# Altium schematic sheet SH9 - RS-485.SchDoc: RS-485
size B; CheckedBy: Cindy Li; DrawnBy: Farris Matar; Engineer: Farris Matar; Organization: UW Robotics; Address1: 200 University Avenue; Address2: Waterloo; Address3: Ontario; Address4: Canada N2L 3G6; DocumentNumber: 9; Revision: 3; SheetNumber: 9; SheetTotal: 9
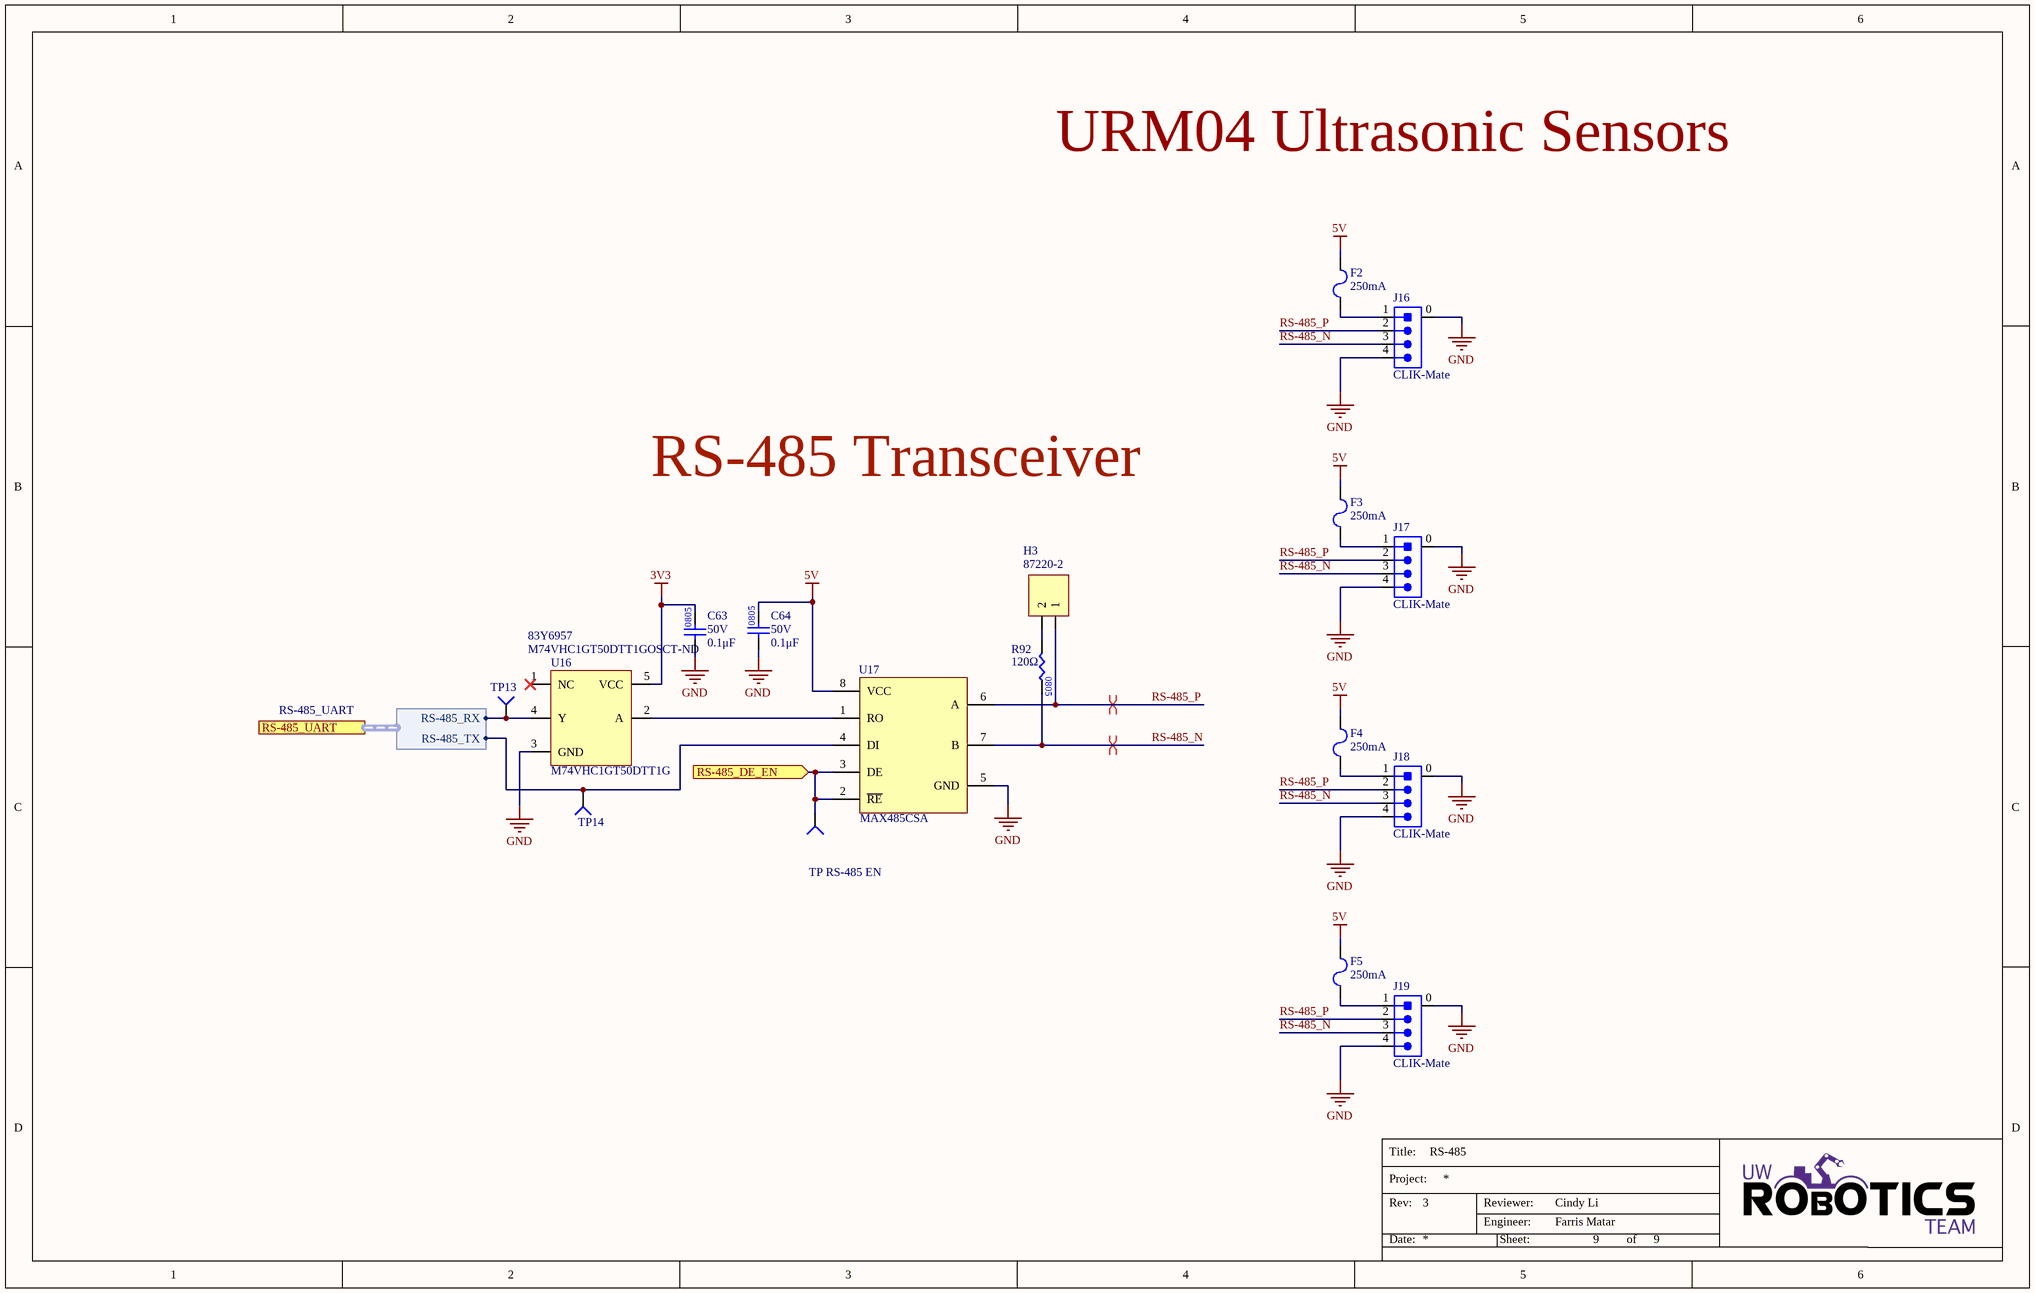
[diagram p0: SH9 - RS-485.SchDoc]

## Parts
C63  value 0.1μF  Voltage Rating: 50V  [CAP2012]  (hidden comment: CAP_0.1uF_50V_0805)
C64  value 0.1μF  Voltage Rating: 50V  [CAP2012]  (hidden comment: CAP_0.1uF_50V_0805)
F2  Current Rating: 250mA  [FUSE_1206]  (hidden comment: FUSE_250mA_1206)
F3  Current Rating: 250mA  [FUSE_1206]  (hidden comment: FUSE_250mA_1206)
F4  Current Rating: 250mA  [FUSE_1206]  (hidden comment: FUSE_250mA_1206)
F5  Current Rating: 250mA  [FUSE_1206]  (hidden comment: FUSE_250mA_1206)
H3  Manufacturer Part Number 1: 87220-2  [HDR1X2]  (hidden comment: JUMPER_2)
J16  Family: CLIK-Mate  [MOLEX-5025850470]  (hidden comment: CON_4M_SM_RA)
J17  Family: CLIK-Mate  [MOLEX-5025850470]  (hidden comment: CON_4M_SM_RA)
J18  Family: CLIK-Mate  [MOLEX-5025850470]  (hidden comment: CON_4M_SM_RA)
J19  Family: CLIK-Mate  [MOLEX-5025850470]  (hidden comment: CON_4M_SM_RA)
R92  value 120Ω  [RES0805]  (hidden comment: RES_120Ω_0805_1%)
TP13  TESTPOINT_1MM_CIRCLE  [TESTPOINT_CIRCLE_1MM]  (value not drawn)  (no BOM)
TP14  TESTPOINT_1MM_CIRCLE  [TESTPOINT_CIRCLE_1MM]  (value not drawn)  (no BOM)
TP_RS-485_EN  TESTPOINT_1MM_CIRCLE  [TESTPOINT_CIRCLE_1MM]  (value not drawn)  (no BOM)
U16  Manufacturer Part Number 1: M74VHC1GT50DTT1G  Supplier Part Number 1: M74VHC1GT50DTT1GOSCT-ND  Supplier Part Number 2: 83Y6957  [SOT23-5]  (hidden comment: IC_BUFFER)
U17  MAX485CSA  [SOIC127P600X175-8N]

## Ports
RS-485_DE_EN (in), RS-485_UART (harness RS-485_UART)

## Harnesses
RS-485_UART: RS-485_RX, RS-485_TX

## Nets
3V3: C63.2 U16.5(VCC)
5V: C64.2 F2.2 F3.2 F4.2 F5.2 U17.8(VCC)
GND: C63.1 C64.1 J16.0 J16.4 J17.0 J17.4 J18.0 J18.4 J19.0 J19.4 U16.3(GND) U17.5(GND)
RS-485_DE_EN: TP_RS-485_EN.1(=value) U17.2(~{RE}) U17.3(DE) ; port RS-485_DE_EN
RS-485_N: J16.3 J17.3 J18.3 J19.3 R92.2 U17.7(B)
RS-485_P: H3.1 J16.2 J17.2 J18.2 J19.2 U17.6(A)
NetF2_1: F2.1 J16.1
NetF3_1: F3.1 J17.1
NetF4_1: F4.1 J18.1
NetF5_1: F5.1 J19.1
NetH3_2: H3.2 R92.1
NetTP13_1: TP13.1(=value) U16.4(Y) ; port RS-485_UART.RS-485_RX
NetTP14_1: TP14.1(=value) U17.4(DI) ; port RS-485_UART.RS-485_TX
NetU16_2: U16.2(A) U17.1(RO)

Not connected (* = marked no-connect by the designer): U16 1(NC)*

## Layout directives
differential pair: RS-485_N, RS-485_P

## Notes on the sheet
- URM04 Ultrasonic Sensors
- RS-485 Transceiver
- Title:
- Project:
- Date:
- Rev:
- Reviewer:
- Engineer:
- Sheet:
- of

## Library data of the parts
C63 C64 = CAP_0.1uF_50V_0805: CAP CER 0.1UF 50V X7R 0805; Manufacturer Part Number 1: GCM21BR71H104KA37K; Manufacturer 1: Murata Electronics; Package/Footprint: 0805; Supplier Part Number 1: 490-8049-1-ND; Supplier 1: Digi-Key; Dielectric: X7R; LCSC Part #: C49678; Mounting Type: SMD
F2-F5 = FUSE_250mA_1206: FUSE BOARD MNT 250MA 125VAC/VDC; Manufacturer 1: Littelfuse; Manufacturer Part Number 1: 0466.250NR; Package/Footprint: 1206; Supplier 1: Digi-Key; Supplier Part Number 1: F1452CT-ND; Mounting Type: SMD
H3 = JUMPER_2: HEADER 2X1; Manufacturer 1: TE Connectivity; Package/Footprint: TH; Supplier 1: Digi-Key; Supplier Part Number 1: A26542-ND; Mount: Through Hole; Mounting Type: TH
J16-J19 = CON_4M_SM_RA: CONN HEADER SMD RIGHT ANGLE 1.5 MM PITCH; Supplier 1: Digi-Key; Supplier Part Number 1: WM9449CT-ND; Package/Footprint: SMD; Mounting Type: SMD
R92 = RES_120Ω_0805_1%: RES 120 OHM 1% 1/8W 0805; Manufacturer 1: Vishay; Manufacturer Part Number 1: CRCW0805120RFKEA; Package/Footprint: 0805; Supplier Part Number 1: 541-120CCT-ND; Supplier 1: Digi-Key; LCSC Part #: C17437; Mounting Type: SMD
TP13 TP14 TP_RS-485_EN = TESTPOINT_1MM_CIRCLE: TESTPOINT 1MM CIRCLE
U16 = IC_BUFFER: IC BUFFER NON-INVERT 5.5V 5TSOP; Manufacturer 1: onsemi; Package/Footprint: TSOP-5; Mounting Type: SMD; Supplier 1: Digi-Key; Supplier 2: Newark
U17 = MAX485CSA: IC RS485 TRANSCEIVER HALF 1/1 8SOIC; Manufacturer 1: Maxim Integrated; Manufacturer Part Number 1: MAX485CSA+T; Protocol: RS422, RS485; Data Rate: 2.5Mbps; Supply Voltage: 4.75V - 5.25V; Package/Footprint: 8-SOIC; Supplier 1: Digi-Key; Supplier Part Number 1: MAX485CSA+TCT-ND; Mounting Type: SMD; LCSC Part #: C9945